# Altium schematic sheet [04] - DRIVERS.SchDoc
size A3; DocumentNumber: 4; SheetNumber: 4; SheetTotal: 6
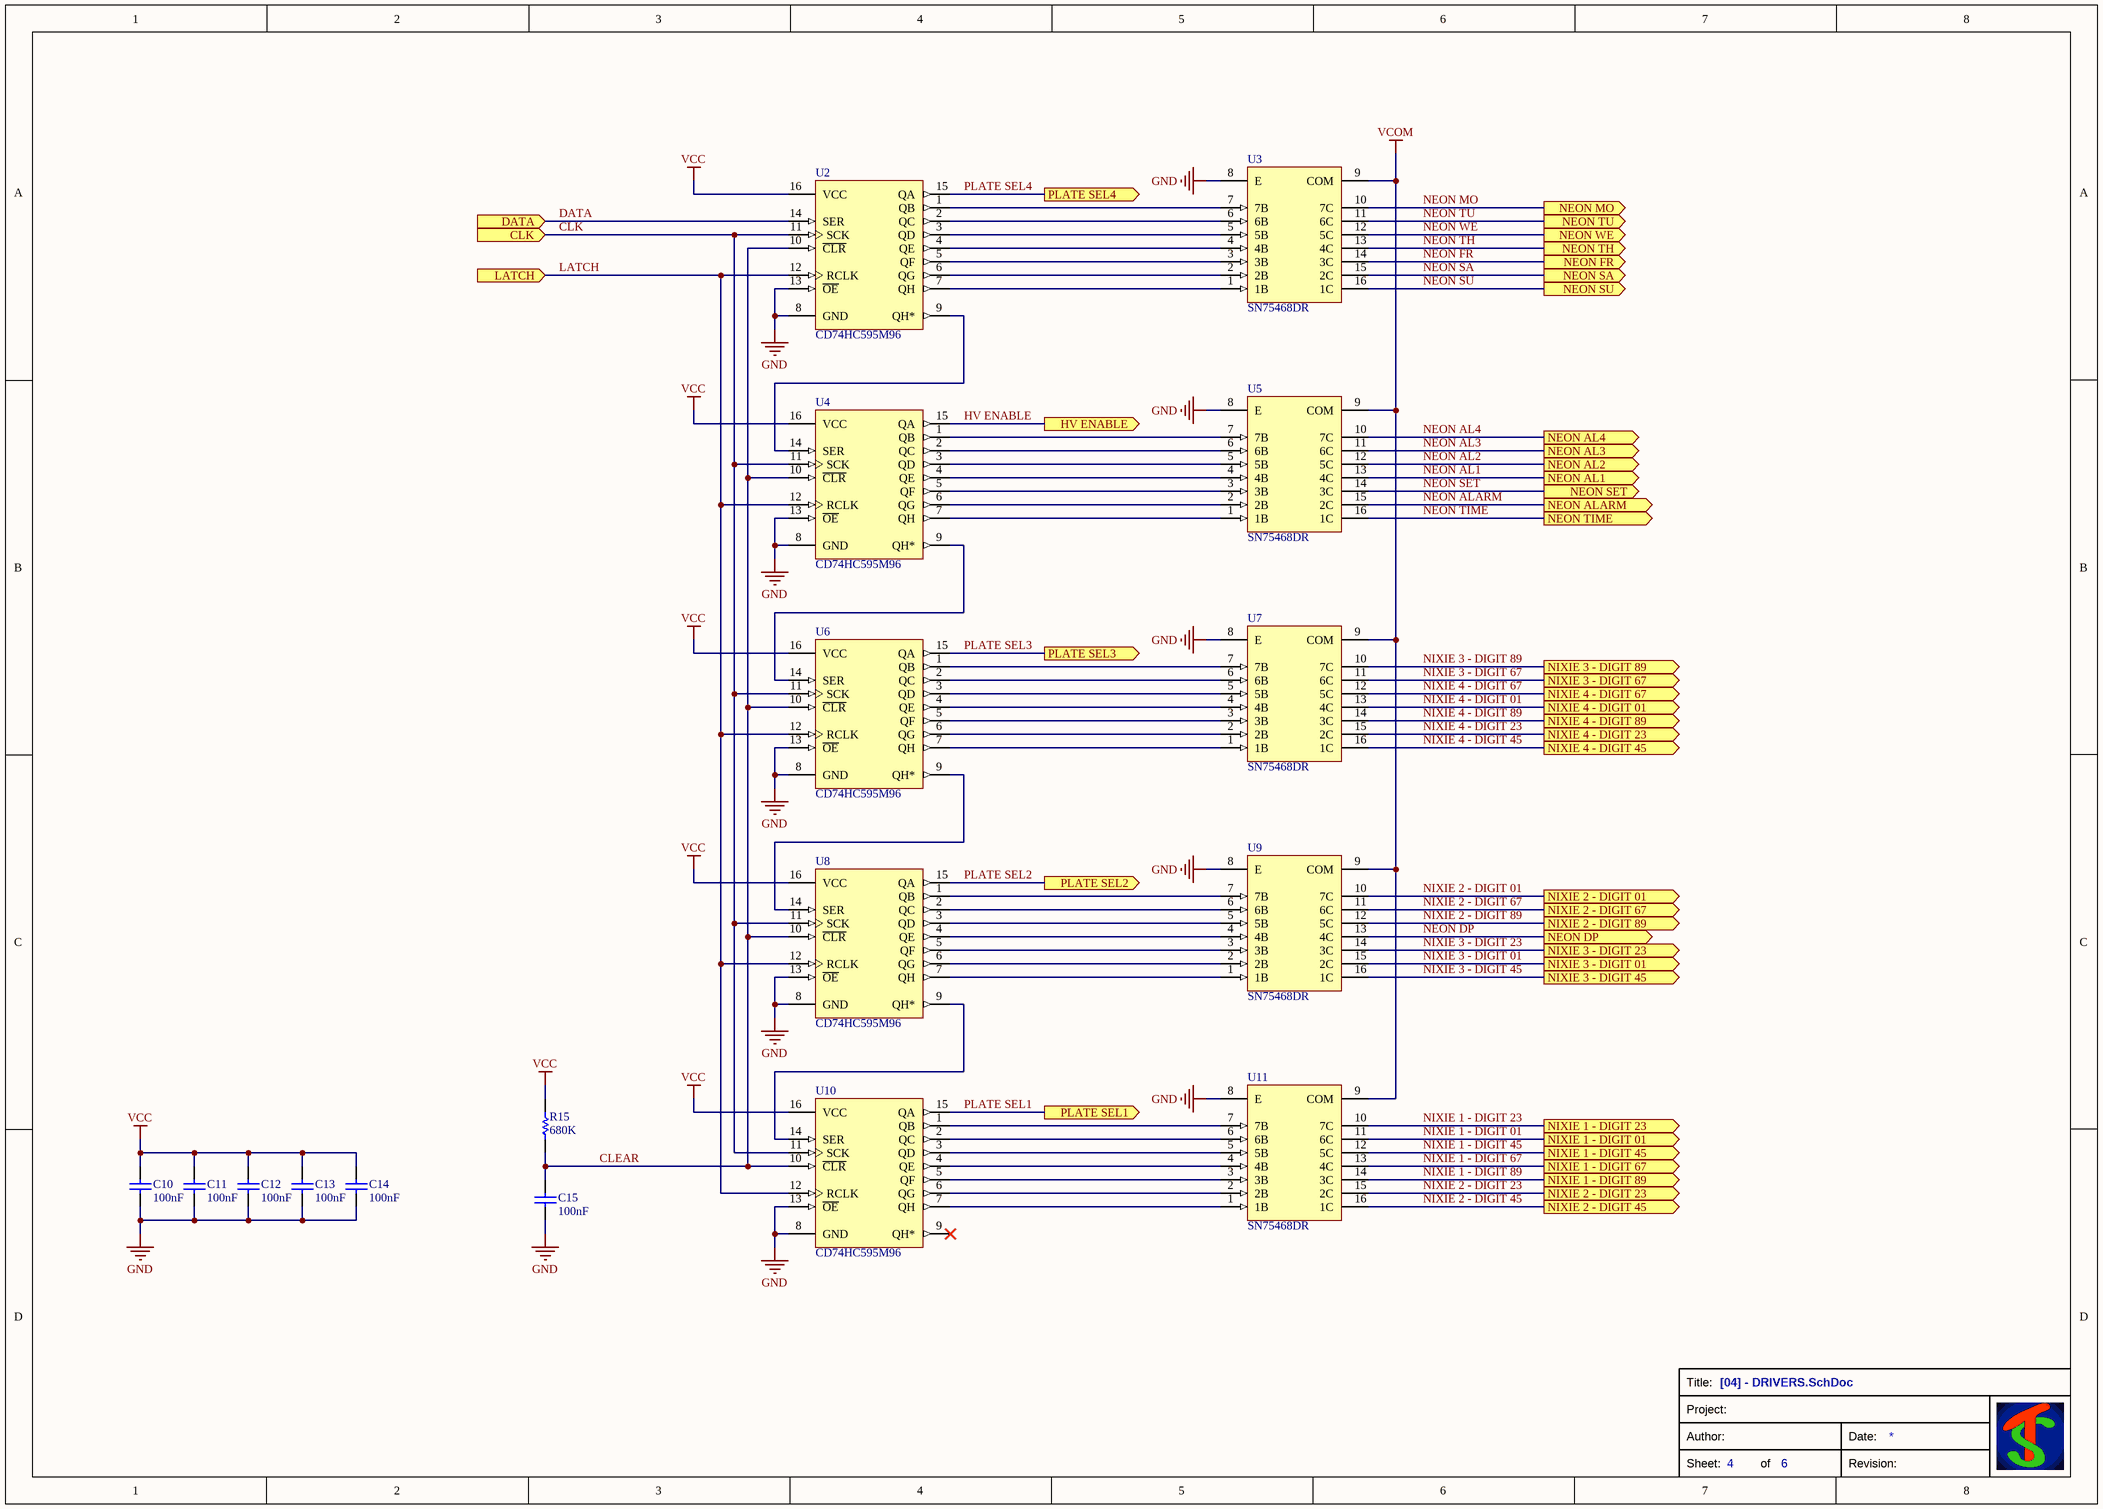
[diagram p0: [04] - DRIVERS.SchDoc]

## Parts
C10  value 100nF  [CAP-1206]  (hidden comment: 885342208002)
C11  value 100nF  [CAP-1206]  (hidden comment: 885342208002)
C12  value 100nF  [CAP-1206]  (hidden comment: 885342208002)
C13  value 100nF  [CAP-1206]  (hidden comment: 885342208002)
C14  value 100nF  [CAP-1206]  (hidden comment: 885342208002)
C15  value 100nF  [CAP-1206]  (hidden comment: 885342208002)
R15  value 680K  [RES-1206]  (hidden comment: RT1206FRE07680KL)
U2  CD74HC595M96  [SOIC127P600X175-16N]
U3  SN75468DR  [SOIC127P600X175-16N]
U4  CD74HC595M96  [SOIC127P600X175-16N]
U5  SN75468DR  [SOIC127P600X175-16N]
U6  CD74HC595M96  [SOIC127P600X175-16N]
U7  SN75468DR  [SOIC127P600X175-16N]
U8  CD74HC595M96  [SOIC127P600X175-16N]
U9  SN75468DR  [SOIC127P600X175-16N]
U10  CD74HC595M96  [SOIC127P600X175-16N]
U11  SN75468DR  [SOIC127P600X175-16N]

## Ports
CLK (in), DATA (in), HV ENABLE (out), LATCH (in), NEON AL1 (out), NEON AL2 (out), NEON AL3 (out), NEON AL4 (out), NEON ALARM (out), NEON DP (out), NEON FR (out), NEON MO (out), NEON SA (out), NEON SET (out), NEON SU (out), NEON TH (out), NEON TIME (out), NEON TU (out), NEON WE (out), NIXIE 1 - DIGIT 01 (out), NIXIE 1 - DIGIT 23 (out), NIXIE 1 - DIGIT 45 (out), NIXIE 1 - DIGIT 67 (out), NIXIE 1 - DIGIT 89 (out), NIXIE 2 - DIGIT 01 (out), NIXIE 2 - DIGIT 23 (out), NIXIE 2 - DIGIT 45 (out), NIXIE 2 - DIGIT 67 (out), NIXIE 2 - DIGIT 89 (out), NIXIE 3 - DIGIT 01 (out), NIXIE 3 - DIGIT 23 (out), NIXIE 3 - DIGIT 45 (out), NIXIE 3 - DIGIT 67 (out), NIXIE 3 - DIGIT 89 (out), NIXIE 4 - DIGIT 01 (out), NIXIE 4 - DIGIT 23 (out), NIXIE 4 - DIGIT 45 (out), NIXIE 4 - DIGIT 67 (out), NIXIE 4 - DIGIT 89 (out), PLATE SEL1 (out), PLATE SEL2 (out), PLATE SEL3 (out), PLATE SEL4 (out)

## Nets
GND: C10.1 C11.1 C12.1 C13.1 C14.1 C15.1 U2.8(GND) U2.13(~{OE}) U3.8(E) U4.8(GND) U4.13(~{OE}) U5.8(E) U6.8(GND) U6.13(~{OE}) U7.8(E) U8.8(GND) U8.13(~{OE}) U9.8(E) U10.8(GND) U10.13(~{OE}) U11.8(E)
VCC: C10.2 C11.2 C12.2 C13.2 C14.2 R15.2 U2.16(VCC) U4.16(VCC) U6.16(VCC) U8.16(VCC) U10.16(VCC)
VCOM: U3.9(COM) U5.9(COM) U7.9(COM) U9.9(COM) U11.9(COM)
CLEAR: C15.2 R15.1 U2.10(~{CLR}) U4.10(~{CLR}) U6.10(~{CLR}) U8.10(~{CLR}) U10.10(~{CLR})
CLK: U2.11(SCK) U4.11(SCK) U6.11(SCK) U8.11(SCK) U10.11(SCK) ; port CLK
DATA: U2.14(SER) ; port DATA
HV ENABLE: U4.15(QA) ; port HV ENABLE
LATCH: U2.12(RCLK) U4.12(RCLK) U6.12(RCLK) U8.12(RCLK) U10.12(RCLK) ; port LATCH
NEON AL1: U5.13(4C) ; port NEON AL1
NEON AL2: U5.12(5C) ; port NEON AL2
NEON AL3: U5.11(6C) ; port NEON AL3
NEON AL4: U5.10(7C) ; port NEON AL4
NEON ALARM: U5.15(2C) ; port NEON ALARM
NEON DP: U9.13(4C) ; port NEON DP
NEON FR: U3.14(3C) ; port NEON FR
NEON MO: U3.10(7C) ; port NEON MO
NEON SA: U3.15(2C) ; port NEON SA
NEON SET: U5.14(3C) ; port NEON SET
NEON SU: U3.16(1C) ; port NEON SU
NEON TH: U3.13(4C) ; port NEON TH
NEON TIME: U5.16(1C) ; port NEON TIME
NEON TU: U3.11(6C) ; port NEON TU
NEON WE: U3.12(5C) ; port NEON WE
NIXIE 1 - DIGIT 01: U11.11(6C) ; port NIXIE 1 - DIGIT 01
NIXIE 1 - DIGIT 23: U11.10(7C) ; port NIXIE 1 - DIGIT 23
NIXIE 1 - DIGIT 45: U11.12(5C) ; port NIXIE 1 - DIGIT 45
NIXIE 1 - DIGIT 67: U11.13(4C) ; port NIXIE 1 - DIGIT 67
NIXIE 1 - DIGIT 89: U11.14(3C) ; port NIXIE 1 - DIGIT 89
NIXIE 2 - DIGIT 01: U9.10(7C) ; port NIXIE 2 - DIGIT 01
NIXIE 2 - DIGIT 23: U11.15(2C) ; port NIXIE 2 - DIGIT 23
NIXIE 2 - DIGIT 45: U11.16(1C) ; port NIXIE 2 - DIGIT 45
NIXIE 2 - DIGIT 67: U9.11(6C) ; port NIXIE 2 - DIGIT 67
NIXIE 2 - DIGIT 89: U9.12(5C) ; port NIXIE 2 - DIGIT 89
NIXIE 3 - DIGIT 01: U9.15(2C) ; port NIXIE 3 - DIGIT 01
NIXIE 3 - DIGIT 23: U9.14(3C) ; port NIXIE 3 - DIGIT 23
NIXIE 3 - DIGIT 45: U9.16(1C) ; port NIXIE 3 - DIGIT 45
NIXIE 3 - DIGIT 67: U7.11(6C) ; port NIXIE 3 - DIGIT 67
NIXIE 3 - DIGIT 89: U7.10(7C) ; port NIXIE 3 - DIGIT 89
NIXIE 4 - DIGIT 01: U7.13(4C) ; port NIXIE 4 - DIGIT 01
NIXIE 4 - DIGIT 23: U7.15(2C) ; port NIXIE 4 - DIGIT 23
NIXIE 4 - DIGIT 45: U7.16(1C) ; port NIXIE 4 - DIGIT 45
NIXIE 4 - DIGIT 67: U7.12(5C) ; port NIXIE 4 - DIGIT 67
NIXIE 4 - DIGIT 89: U7.14(3C) ; port NIXIE 4 - DIGIT 89
PLATE SEL1: U10.15(QA) ; port PLATE SEL1
PLATE SEL2: U8.15(QA) ; port PLATE SEL2
PLATE SEL3: U6.15(QA) ; port PLATE SEL3
PLATE SEL4: U2.15(QA) ; port PLATE SEL4
NetU2_1: U2.1(QB) U3.7(7B)
NetU2_2: U2.2(QC) U3.6(6B)
NetU2_3: U2.3(QD) U3.5(5B)
NetU2_4: U2.4(QE) U3.4(4B)
NetU2_5: U2.5(QF) U3.3(3B)
NetU2_6: U2.6(QG) U3.2(2B)
NetU2_7: U2.7(QH) U3.1(1B)
NetU2_9: U2.9(QH*) U4.14(SER)
NetU4_1: U4.1(QB) U5.7(7B)
NetU4_2: U4.2(QC) U5.6(6B)
NetU4_3: U4.3(QD) U5.5(5B)
NetU4_4: U4.4(QE) U5.4(4B)
NetU4_5: U4.5(QF) U5.3(3B)
NetU4_6: U4.6(QG) U5.2(2B)
NetU4_7: U4.7(QH) U5.1(1B)
NetU4_9: U4.9(QH*) U6.14(SER)
NetU6_1: U6.1(QB) U7.7(7B)
NetU6_2: U6.2(QC) U7.6(6B)
NetU6_3: U6.3(QD) U7.5(5B)
NetU6_4: U6.4(QE) U7.4(4B)
NetU6_5: U6.5(QF) U7.3(3B)
NetU6_6: U6.6(QG) U7.2(2B)
NetU6_7: U6.7(QH) U7.1(1B)
NetU6_9: U6.9(QH*) U8.14(SER)
NetU8_1: U8.1(QB) U9.7(7B)
NetU8_2: U8.2(QC) U9.6(6B)
NetU8_3: U8.3(QD) U9.5(5B)
NetU8_4: U8.4(QE) U9.4(4B)
NetU8_5: U8.5(QF) U9.3(3B)
NetU8_6: U8.6(QG) U9.2(2B)
NetU8_7: U8.7(QH) U9.1(1B)
NetU8_9: U8.9(QH*) U10.14(SER)
NetU10_1: U10.1(QB) U11.7(7B)
NetU10_2: U10.2(QC) U11.6(6B)
NetU10_3: U10.3(QD) U11.5(5B)
NetU10_4: U10.4(QE) U11.4(4B)
NetU10_5: U10.5(QF) U11.3(3B)
NetU10_6: U10.6(QG) U11.2(2B)
NetU10_7: U10.7(QH) U11.1(1B)

Not connected (* = marked no-connect by the designer): U10 9(QH*)*

## Notes on the sheet
- Title:
- Project:
- Sheet:
- Author:
- of
- Revision:
- Date:

## Library data of the parts
C10-C15 = CAP-1206-100n-885342208002: Condensatori in ceramica multistrato MLCC - SMD/SMT WCAP-CSMH 200V 0.1uF 1206 10%; Manufacturer: KEMET; Voltage Rating DC: 16 VDC; Voltage Rating: 16V; Tolerance: 20%; Dielectric: X7R; Supplier 1: Mouser; Supplier Part Number 1: 710-885342208002
R15 = RES-1206-680K-RT1206FRE07680KL: Thin Film Resistors 680K OHM 1% 50PPM 1/4W; Manufacturer: Yageo; Power Rating: 1/10W; Voltage Rating: 75V; Tolerance: 1%; Supplier 1: Mouser; Supplier Part Number 1: 603-RT1206FRE07680KL
U2 U4 U6 U8 U10 = CD74HC595: 8-Bit Shift Register; Supplier 1: Mouser; Supplier Part Number 1: 595-CD74HC595M96
U3 U5 U7 U9 U11 = SN75468: High Voltage Darlington Transistor Arrays; Supplier 1: Mouser; Supplier Part Number 1: 595-SN75468DR